# Altium project Mach_khuech_dai_am_thanh.PrjPcb
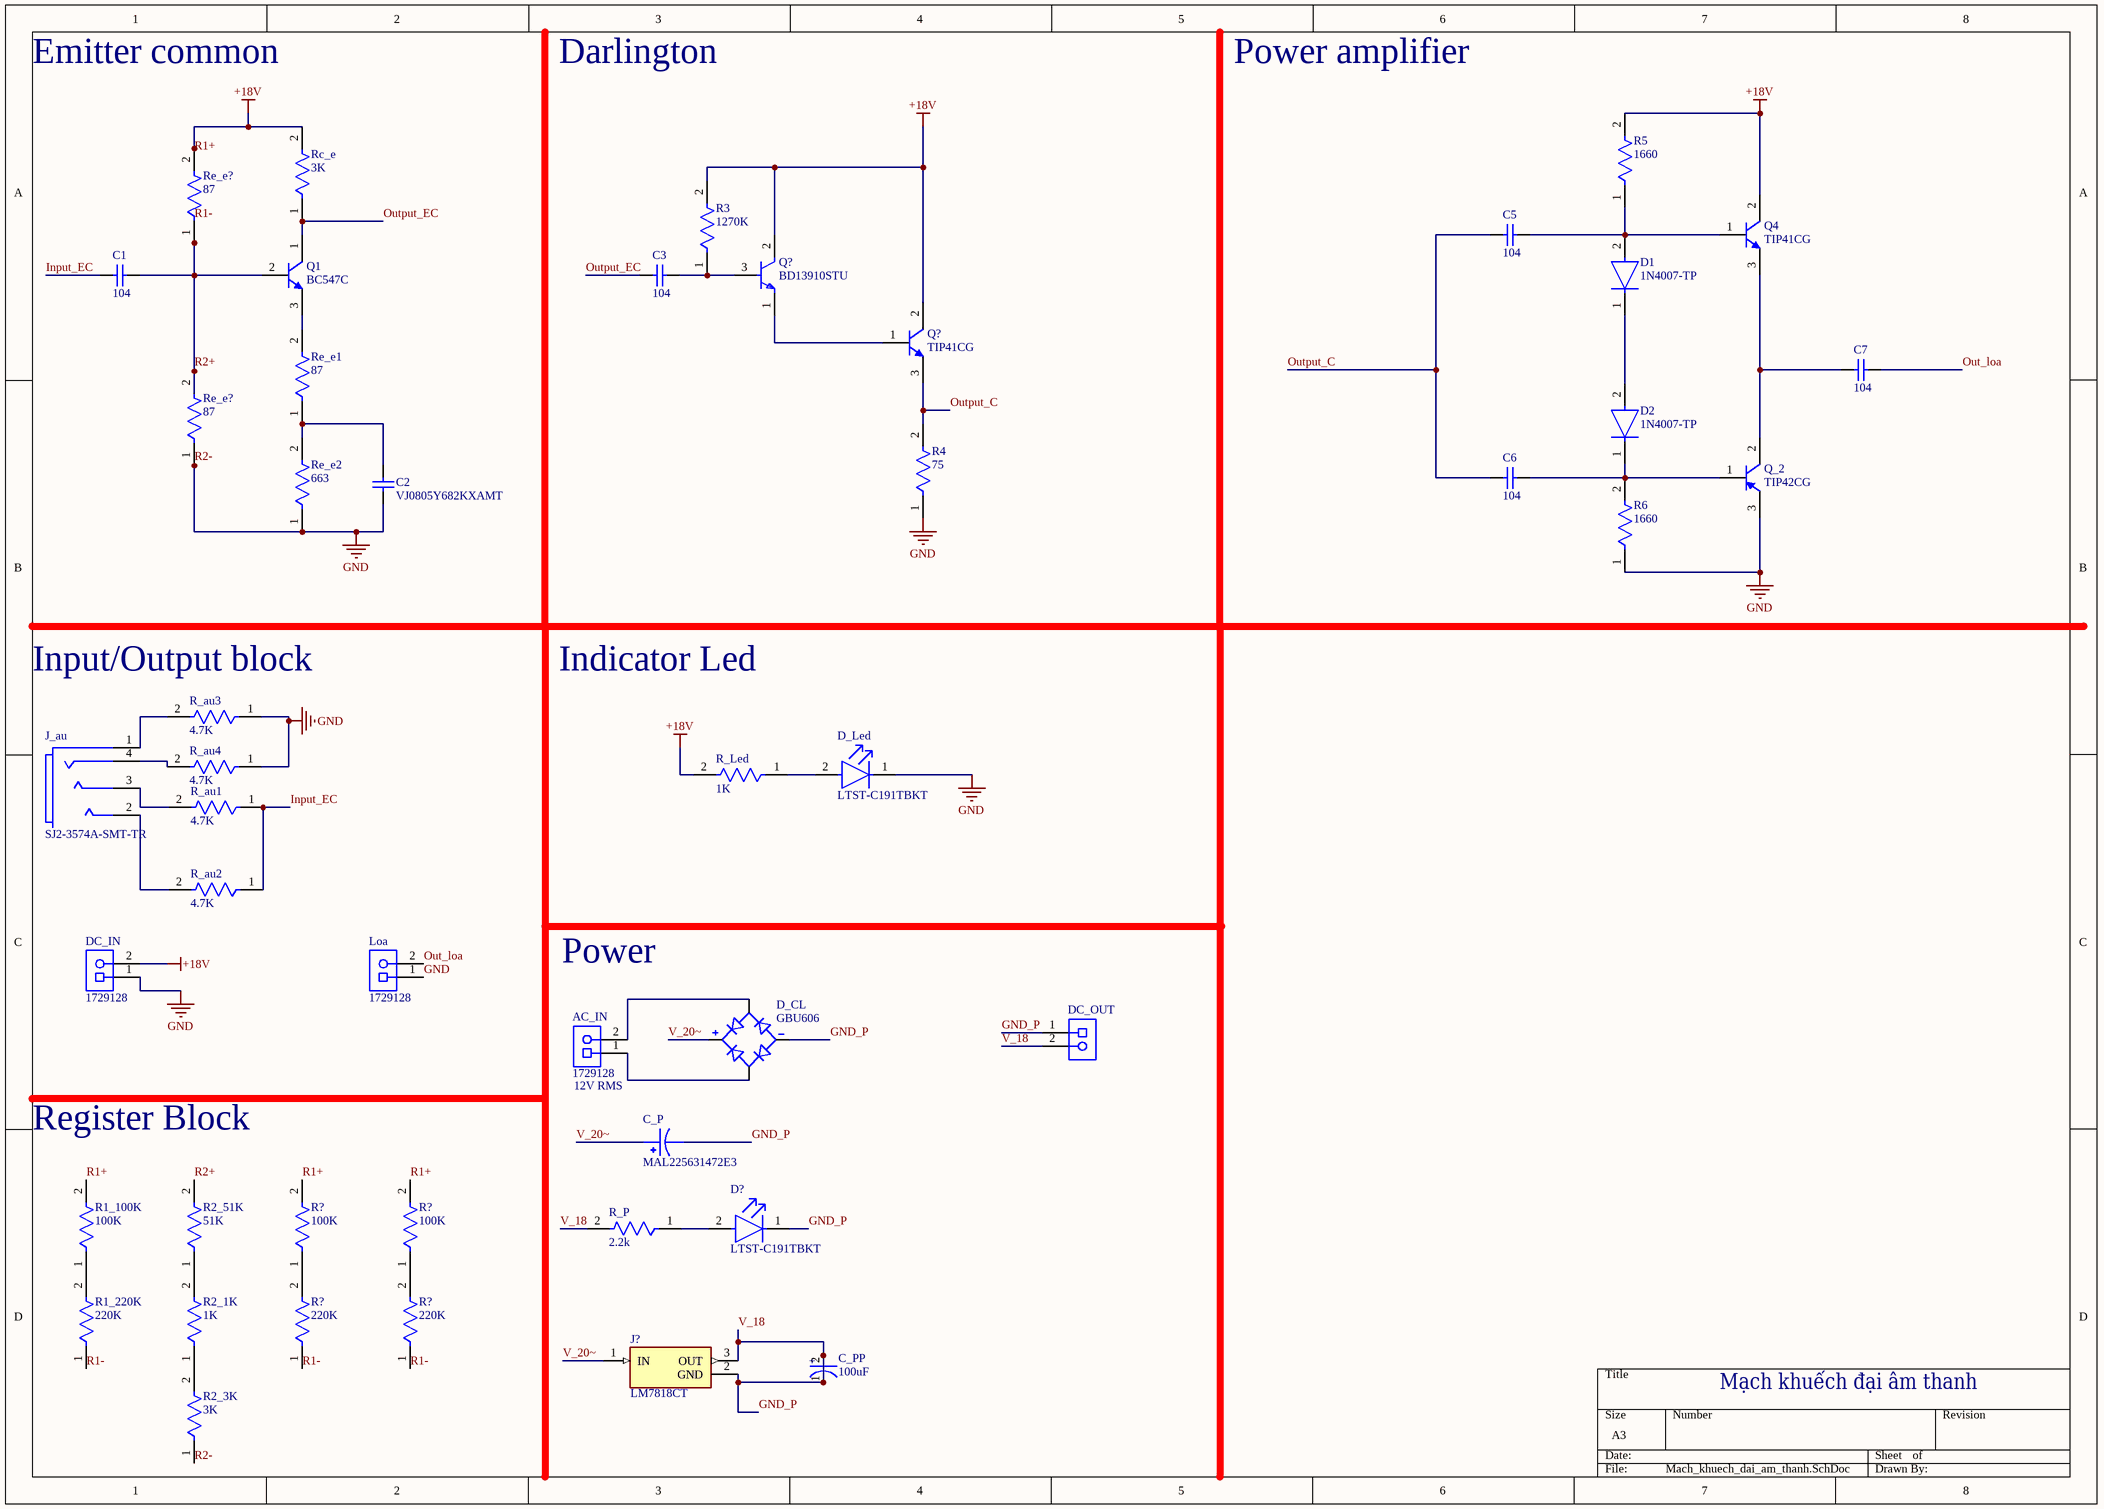
[diagram p0: Mach_khuech_dai_am_thanh.SchDoc]
1 sheet, 48 parts. Net scope: global (net labels, ports and power ports of the same name join across sheets).
Board file: Mach_khuech_dai_am_thanh.PcbDoc

## Sheet Mach_khuech_dai_am_thanh.SchDoc
size A3; SheetNumber: 1; SheetTotal: 1

### Parts
(Parts that share a designator on the sheet are numbered #1, #2 ... from top to bottom, then left to right.)
AC_IN  1729128  [PHOE-1729128-2_V]
C1  104  [CAPC2013X145X48ML20T23]
C2  VJ0805Y682KXAMT  [CAPC2013X145X48ML20T23]
C3  104  [CAPC2013X145X48ML20T23]
C5  104  [CAPC2013X145X48ML20T23]
C6  104  [CAPC2013X145X48ML20T23]
C7  104  [CAPC2013X145X48ML20T23]
C_P  MAL225631472E3  [CAP_MAL225631472E3]
C_PP  100uF  [FP-RAD-TH-D_10_0_5-L_16_1-MFG]
D1  1N4007-TP  [FP-1N4007-TP-MFG]
D2  1N4007-TP  [FP-1N4007-TP-MFG]
D?  LTST-C191TBKT  [FP-LTST-C191TBKT-MFG]
D_CL  GBU606  [SIP343W114P508L2205H2134Q4]
D_Led  LTST-C191TBKT  [FP-LTST-C191TBKT-MFG]
DC_IN  1729128  [PHOE-1729128-2_V]
DC_OUT  (no value)  [PHOE-1729128-2_V]
J?  LM7818CT  [TO-220-3]
J_au  SJ2-3574A-SMT-TR  [FP-SJ2-3574A-SMT-TR-MFG]
Loa  1729128  [PHOE-1729128-2_V]
Q1  BC547C  [ONSC-TO-92-3-29-11]
Q4  TIP41CG  [ONSC-TO-220-3-221A-09]
Q?#1  BD13910STU  [FP-340AS-MFG]
Q?#2  TIP41CG  [ONSC-TO-220-3-221A-09]
Q_2  TIP42CG  [ONSC-TO-220-3-221A-09]
R1_100K  100K  [FP-RK73H2A-MFG]
R1_220K  220K  [FP-RK73H2A-MFG]
R2_1K  1K  [FP-RK73H2A-MFG]
R2_3K  3K  [FP-RK73H2A-MFG]
R2_51K  51K  [FP-RK73H2A-MFG]
R3  1270K  [FP-RK73H2A-MFG]
R4  75  [FP-RK73H2A-MFG]
R5  1660  [FP-RK73H2A-MFG]
R6  1660  [FP-RK73H2A-MFG]
R?#1  100K  [FP-RK73H2A-MFG]
R?#2  100K  [FP-RK73H2A-MFG]
R?#3  220K  [FP-RK73H2A-MFG]
R?#4  220K  [FP-RK73H2A-MFG]
R_au1  4.7K  [FP-RK73H2A-MFG]
R_au2  4.7K  [FP-RK73H2A-MFG]
R_au3  4.7K  [FP-RK73H2A-MFG]
R_au4  4.7K  [FP-RK73H2A-MFG]
R_Led  1K  [FP-RK73H2A-MFG]
R_P  2.2k  [FP-RK73H2A-MFG]
Rc_e  3K  [FP-RK73H2A-MFG]
Re_e1  87  [FP-RK73H2A-MFG]
Re_e2  663  [FP-RK73H2A-MFG]
Re_e?#1  87  [FP-RK73H2A-MFG]
Re_e?#2  87  [FP-RK73H2A-MFG]

### Nets
GND: C2.1 D_Led.1(C) DC_IN.1 Loa.1 Q_2.3(E) R2_3K.1 R4.1 R6.1 R_au3.1 R_au4.1 Re_e2.1 Re_e?#2.1  [also labelled R2-]
R1+: DC_IN.2 Q4.2(C) Q?#1.2(C) Q?#2.2(C) R1_100K.2 R3.2 R5.2 R?#1.2 R?#2.2 R_Led.2 Rc_e.2 Re_e?#1.2  [also labelled +18V]
GND_P: C_P.2 C_PP.1(C) C_PP.2(A) D?.1(C) D_CL.NEG DC_OUT.1 DC_OUT.2 J?.2(GND) J?.3(OUT) R_P.2  [also labelled V_18]
Input_EC: C1.1 R_au1.1 R_au2.1
Out_loa: C7.2 Loa.2
Output_C: C5.1 C6.1 Q?#2.3(E) R4.2
Output_EC: C3.1 Q1.1(C) Rc_e.1
R1-: C1.2 Q1.2(B) R1_220K.1 R2_51K.2 R?#3.1 R?#4.1 Re_e?#1.1 Re_e?#2.2  [also labelled R2+]
V_20~: C_P.1 D_CL.POS J?.1(IN)
NetAC_IN_1: AC_IN.1 D_CL.AC2
NetAC_IN_2: AC_IN.2 D_CL.AC1
NetC2_2: C2.2 Re_e1.1 Re_e2.2
NetC3_2: C3.2 Q?#1.3(B) R3.1
NetC5_2: C5.2 D1.2(A) Q4.1(B) R5.1
NetC6_2: C6.2 D2.1(C) Q_2.1(B) R6.2
NetC7_1: C7.1 Q4.3(E) Q_2.2(C)
NetD1_1: D1.1(C) D2.2(A)
NetD?_2: D?.2(A) R_P.1
NetD_Led_2: D_Led.2(A) R_Led.1
NetJ_au_1: J_au.1(sleeve) R_au3.2
NetJ_au_2: J_au.2(tip) R_au2.2
NetJ_au_3: J_au.3(ring_1) R_au1.2
NetJ_au_4: J_au.4(ring_2) R_au4.2
NetQ1_3: Q1.3(E) Re_e1.2
NetQ?#1_1: Q?#1.1(E) Q?#2.1(B)
NetR1_100K_1: R1_100K.1 R1_220K.2
NetR2_1K_1: R2_1K.1 R2_3K.2
NetR2_1K_2: R2_1K.2 R2_51K.1
NetR?#1_1: R?#1.1 R?#3.2
NetR?#2_1: R?#2.1 R?#4.2

### Notes on the sheet
- Emitter common
- Darlington
- Power amplifier
- (near R_au3) Input/Output block
- Indicator Led
- Power
- (near AC_IN) 12V RMS
- Register Block
- Mạch khuếch đại âm thanh
- (in symbol CMP-05427-000510-1) +

### Library data of the parts
AC_IN DC_IN Loa = CMP-2000-05815-1: PCB Terminal Block, 13.5 A, 400 V, 2-Pin THD, RoHS, Bulk; Manufacturer: Phoenix Contact; Package Version: 03/2015; No. of Rows: 1; Pitch: 5.08mm; No. of Positions: 2; Voltage Rating: 400V; Current Rating: 13500mA; Manufacturer URL: http://www.phoenixcontact.com/; Datasheet URL: https://datasheet.ciiva.com/16046/1729128-16046181.pdf; RoHS: TRUE; Package URL: https://www.phoenixcontact.com/online/portal/pi/pxc/product_detail_page/!ut/p/b1/3VdJjqNKFDxLH8AFycySyWY2ozFsEPOMMQaDOX1XedGL_1Vdm5YXJleknhSKeBkvI6EA8ncAo3AYoDhBQGco6KN7VURTdemj9us_IEKEZo_YHiPAEWEFmDGOHMORkqKYCORBZxgL7ZoaZYcbFFUZ3fqxSY6GOuxydWUuHqz1ynmMFygu583Bob0Ewr6Sd_l-5m-kAueHiB0jpRwZwe58wwtkpxtMYd_LmGcDRU02dRNEyWt6Y2ti5pSyJ_reIkzIulrqApdnbT11V5jnCKbYNCvhEM1MCpPByat_X379-iThf08CI5GfOPqfBeS3BRoBOdD55AKVv0iLwCMq-2BrzXWSGRH7pUGD9uwXQjiph3xL0DKQwdGa0JImiIOmBNOestqgwTHSSs2oOep-78apyXQBvNi8ZLaFjvjWvcaUEBu0MC6Wbe-d6mB0FAebo2lUWinqYaZs5DAYzV0RP9yitUjnGJ0iI9xhZkT42OCQNUJJhkgWINNQLP2JFP6OpMg3JCVg70jqHT0lvKOnhHf0lPuOnnLf0VPuWx6_dxwUIvwk5WMkT0kLL1mh61l2yZVSzG3pYV_bqo-mj6uMKwKwdnnW8Jh5RTOJzMOA5c-eJDaZQw4mTMPH02PvS_ZAqNVjVTo2WyYLkwH_KU1mmmG5kjRhDqPXLwwVHvVOjCM60-fpXvTDfMGW1PVFVS1r4e4yVDk4ZdNbkUHvqPqQSeian4UD39fNKmachqdJ1NJbyk8rXT9mXTvPk3oE5meulKGgiruPJek-4I9hTT6G8ZLOyRSm2RRVbThERQad5OS28hdt4YW4vG0stgYYzsWsK4_7y6DZMjJSCqri1kyiZR5vD7pwIrNR7QwPHTcLTI5qT7eRlpHrdGiupYlqQDJ7zy_CND8fWWBoLRXxk1RVcXiBQwbTD4Xi7KL-FuO94t9xaqweXzH; PartNumber: 1729128; Package Description: 2-Pin Through Hole Device, Body 8.1 x 10.16 mm, Pitch 5.08 mm; Datasheet Version: 12/2013; Mounting Technology: ThroughHole; Orientation: Horizontal; Package Reference: 1729128-2; Packing: Bulk
C1 C3 C5-C7 = CMP-2007-03205-1: Manufacturer: Vitramon; Part Number: VJ0805Y682KXAMT
C2 = CMP-2007-03205-1: Manufacturer: Vitramon; Part Number: VJ0805Y682KXAMT
C_PP = CMP-05427-000510-1: Aluminum Electrolytic Capacitors (Radial Lead Type) AEC-Q200 Qualified 820uF ±20% 10V; ESR (Equivalent Series Resistance): 68mR; Ripple Current: 1.05A; Lead Diameter: 0.6mm; Dielectric Material: Aluminium; Leakage Current: 3uA; Life (Hours): 3000Hour; Package Quantity: 200; Construction: RADIAL; Radiation Hardening: No; Voltage Rating: 10V; Height - Seated (Max): 0.63inch; Case/Package: Radial; Lead Free: Lead Free; Voltage Rating (DC): 10V; Voltage: 10V; RoHS Compliant: Yes; Max Operating Temperature: 105°C; Number of Pins: 2; Impedance: 68mR; Length: 16mm; REACH SVHC: No SVHC; Lead Pitch: 5mm; Termination: Radial; Mount: Through Hole; Capacitance: 820uF; Min Operating Temperature: -55°C; Diameter: 10mm; Height: 16mm; Ripple Current (AC): 1.05A; Series: FC; Packaging: Bulk; Tolerance: 20%
D1 D2 = CMP-56207-000011-1: DIODE GEN PURP 1KV 1A DO41; Max Surge Current: 30A; Recovery Time: 2000ns; Element Configuration: Single; Polarity: Standard; Reverse Recovery Time: 2us; Capacitance: 15pF; Forward Voltage: 1V; Max Reverse Current: 5uA; Radiation Hardening: No; Number of Pins: 2; Current Rating: 1A; Reverse Voltage: 1kV; Output Current: 1A; Mount: Through Hole; Average Rectified Current: 1A; Lead Free: Lead Free; Peak Non-Repetitive Surge Current: 30A; Max Reverse Voltage (DC): 1kV; Voltage Rating (DC): 1kV; Max Repetitive Reverse Voltage (Vrrm): 1kV; Diameter: 2.7mm; Forward Current: 1A; RoHS Compliant: Yes; Package Quantity: 1; Length: 5.2mm; Max Forward Surge Current (Ifsm): 30A; Packaging: Tape and Reel; Case/Package: DO-41; Min Operating Temperature: -55°C; Max Operating Temperature: 150°C
D? D_Led = CMP-22017-000008-1: LED BLUE CLEAR CHIP SMD; Lens Color: Colorless; Dominant Wavelength: 475nm; Forward Current: 20mA; Wavelength: 468nm; Viewing Angle: 130°; Power Dissipation: 76mW; Luminous Intensity: 180mcd; Reverse Voltage: 5V; Number of Elements: 1; Lens Style: Diffused; Forward Voltage: 3.8V; Max Power Dissipation: 75mW; Case Code (Metric): 1608; Packaging: Tape and Reel; Case/Package: 0603; Depth: 1.6mm; Mount: Surface Mount; Lead Free: Lead Free; Min Operating Temperature: -20°C; Lens Transparency: Clear; Illumination Color: Blue; Height: 0.55mm; Test Current: 20mA; Case Code (Imperial): 0603; Max Operating Temperature: 80°C; Number of Pins: 2; Length: 0.8mm; Radiation Hardening: No; Package Quantity: 1; Number of LEDs: 1; Width: 0.8mm; Color: Blue
D_CL = GBU606: 6A 600V Bridge Rectifier Case GBU | Diodes Inc GBU606; MF: Diodes Inc.; SnapEDA_Link: https://www.snapeda.com/parts/GBU606/Diodes+Inc./view-part/?ref=snap; Package: SIP-4 Diodes Incorporated; Value: *; MP: GBU606; Check_prices: https://www.snapeda.com/parts/GBU606/Diodes+Inc./view-part/?ref=eda
DC_OUT = CMP-2000-05815-1: PCB Terminal Block, 13.5 A, 400 V, 2-Pin THD, RoHS, Bulk; PartNumber: 1729128; Manufacturer: Phoenix Contact; Package Version: 03/2015; No. of Rows: 1; Pitch: 5.08mm; No. of Positions: 2; Voltage Rating: 400V; Current Rating: 13500mA; Manufacturer URL: http://www.phoenixcontact.com/; Datasheet URL: https://datasheet.ciiva.com/16046/1729128-16046181.pdf; RoHS: TRUE; Package URL: https://www.phoenixcontact.com/online/portal/pi/pxc/product_detail_page/!ut/p/b1/3VdJjqNKFDxLH8AFycySyWY2ozFsEPOMMQaDOX1XedGL_1Vdm5YXJleknhSKeBkvI6EA8ncAo3AYoDhBQGco6KN7VURTdemj9us_IEKEZo_YHiPAEWEFmDGOHMORkqKYCORBZxgL7ZoaZYcbFFUZ3fqxSY6GOuxydWUuHqz1ynmMFygu583Bob0Ewr6Sd_l-5m-kAueHiB0jpRwZwe58wwtkpxtMYd_LmGcDRU02dRNEyWt6Y2ti5pSyJ_reIkzIulrqApdnbT11V5jnCKbYNCvhEM1MCpPByat_X379-iThf08CI5GfOPqfBeS3BRoBOdD55AKVv0iLwCMq-2BrzXWSGRH7pUGD9uwXQjiph3xL0DKQwdGa0JImiIOmBNOestqgwTHSSs2oOep-78apyXQBvNi8ZLaFjvjWvcaUEBu0MC6Wbe-d6mB0FAebo2lUWinqYaZs5DAYzV0RP9yitUjnGJ0iI9xhZkT42OCQNUJJhkgWINNQLP2JFP6OpMg3JCVg70jqHT0lvKOnhHf0lPuOnnLf0VPuWx6_dxwUIvwk5WMkT0kLL1mh61l2yZVSzG3pYV_bqo-mj6uMKwKwdnnW8Jh5RTOJzMOA5c-eJDaZQw4mTMPH02PvS_ZAqNVjVTo2WyYLkwH_KU1mmmG5kjRhDqPXLwwVHvVOjCM60-fpXvTDfMGW1PVFVS1r4e4yVDk4ZdNbkUHvqPqQSeian4UD39fNKmachqdJ1NJbyk8rXT9mXTvPk3oE5meulKGgiruPJek-4I9hTT6G8ZLOyRSm2RRVbThERQad5OS28hdt4YW4vG0stgYYzsWsK4_7y6DZMjJSCqri1kyiZR5vD7pwIrNR7QwPHTcLTI5qT7eRlpHrdGiupYlqQDJ7zy_CND8fWWBoLRXxk1RVcXiBQwbTD4Xi7KL-FuO94t9xaqweXzH; Package Description: 2-Pin Through Hole Device, Body 8.1 x 10.16 mm, Pitch 5.08 mm; Datasheet Version: 12/2013; Mounting Technology: ThroughHole; Orientation: Horizontal; Package Reference: 1729128-2; Packing: Bulk
J? = LM7818CT: Linear Voltage Regulator IC Positive Fixed 1 Output 1A TO-220-3; MF: ON Semiconductor; Check_prices: https://www.snapeda.com/parts/LM7818CT/Onsemi/view-part/?ref=eda; Value: *; Availability: In Stock; MP: LM7818CT; Price: None; Package: TO-220-3 ON Semiconductor; SnapEDA_Link: https://www.snapeda.com/parts/LM7818CT/Onsemi/view-part/?ref=snap; Purchase-URL: https://pricing.snapeda.com/search/part/LM7818CT/?ref=eda
J_au = CMP-14818-000001-1: Manufacturer: CUI; Conn Orientation: Horizontal; Current Rating: 1A; Number Of Contacts: 4; Voltage Rating: 12V; Package: SJ2-3574A-SMT-TR; Device Class L1: Connectors; Lead Free: Yes; Digikey Description: AUDIO JACK, 3.5 MM, RT, 4 CONDUC; Device Class L2: Audio / Video Connectors; ComponentLink2URL: https://www.cui.com/product/resource/sj2-357x-smt.pdf; Automotive: No; RoHS: TRUE; Height: 5.3mm; Temperature Range Low: -25°C; Category: Conn; Temperature: -25°C to +85°C; Octopart: https://octopart.com/sj2-3574a-smt-tr-cui-77838840; Device Class L3: unset; Contact Material: Silver; Manufacturer Part Number: SJ2-3574A-SMT-TR; Temperature Range High: +85°C; ComponentLink2Description: Datasheet
Q1 = CMP-1048-01437-1: Amplifier Transistor, NPN Silicon, 3-Pin TO-92, Bulk Box; Manufacturer: On Semiconductor; IC Continuous (A): 0.1; fT Min (MHz): 150; Mounting Technology: Through Hole; ComponentLink1URL: http://www.onsemi.com/; ComponentLink1Description: Manufacturer URL; ComponentLink3URL: http://www.onsemi.cn/pub_link/Collateral/2N6426-D.PDF; DatasheetVersion: Rev. 7; PackageVersion: Rev. AM; Packing: Bulk Box; RoHS: FALSE; Polarity: NPN; PartNumber: BC547C; ComponentLink2URL: http://www.onsemi.com/pub_link/Collateral/BC546-D.PDF; ComponentLink3Description: Package Specification; PackageDescription: 3-Pin Transistor Outline, Body 4.825 x 3.685 mm, Pitch 1.27 mm; PackageReference: TO-92-3-29-11_AM_SL; ComponentLink2Description: Datasheet
Q4 Q?#2 = CMP-1048-01176-1: Complementary Silicon Plastic Power Transistor, 3-Pin TO-220, Pb-Free, Tube; Manufacturer: On Semiconductor; fT Min (MHz): 3; Polarity: NPN; IC Continuous (A): 6; ComponentLink2URL: http://www.onsemi.com/pub_link/Collateral/TIP41A-D.PDF; ComponentLink2Description: Datasheet; RoHS: TRUE; ComponentLink1Description: Manufacturer URL; ComponentLink1URL: http://www.onsemi.com/; PackageDescription: 3-Pin Flange Mount, Vertical Straight Lead, Body 9.97 x 4.445 mm, Pitch 2.54 mm; Packing: Tube; PartNumber: TIP41CG; DatasheetVersion: Rev. 10; PackageVersion: Rev. AG, 09/2011; ComponentLink3Description: Package Specification; PackageReference: TO-220-3-221A-09; Mounting Technology: Through Hole; ComponentLink3URL: http://www.onsemi.com/pub_link/Collateral/221A-09.PDF
Q?#1 = CMP-00278-84408974-1: BD13910STU Bipolar (BJT) Single Transistor, NPN, 80 V, 12.5 W, 1.5 A, 63; Manufacturer Lifecycle Status: ACTIVE; Max Power Dissipation: 1.25W; Collector Base Voltage (VCBO): 80V; Current Rating: 1.5A; hFE Min: 40; Number of Elements: 1; Collector Emitter Saturation Voltage: 500mV; Emitter Base Voltage (VEBO): 5V; Number of Pins: 3; Min Operating Temperature: -55°C; Contact Plating: Tin; Height: 11.2mm; Collector Emitter Breakdown Voltage: 80V; Weight: 761mg; Collector Emitter Voltage (VCEO): 80V; Voltage Rating (DC): 80V; Polarity: NPN; Length: 8.3mm; Lifecycle Status: Production; RoHS: Compliant; Max Collector Current: 1.5A; Case/Package: TO-126; Schedule B: 8541290080, 8541290080; Width: 3.45mm; Max Operating Temperature: 150°C; Lead Free: Lead Free; Mount: Through Hole; REACH SVHC: No SVHC; Element Configuration: Single; NexarPartId: 84408974; Power Dissipation: 1.25W
Q_2 = CMP-1048-01106-1: Complementary Silicon Plastic Power Transistor, 3-Pin TO-220, Pb-Free, Tube; Manufacturer: On Semiconductor; IC Continuous (A): 6; Polarity: PNP; fT Min (MHz): 3; ComponentLink2Description: Datasheet; ComponentLink1URL: http://www.onsemi.com/; ComponentLink2URL: http://www.onsemi.com/pub_link/Collateral/TIP41A-D.PDF; PackageVersion: Rev. AG, 09/2011; PartNumber: TIP42CG; ComponentLink3URL: http://www.onsemi.com/pub_link/Collateral/221A-09.PDF; PackageDescription: 3-Pin Flange Mount, Vertical Straight Lead, Body 9.97 x 4.445 mm, Pitch 2.54 mm; ComponentLink1Description: Manufacturer URL; Packing: Tube; ComponentLink3Description: Package Specification; PackageReference: TO-220-3-221A-09; RoHS: TRUE; DatasheetVersion: Rev. 10; Mounting Technology: Through Hole
R1_100K R1_220K R2_1K R2_3K R2_51K R3-R6 R?#1-R?#4 R_au1-R_au4 R_Led R_P Rc_e Re_e1 Re_e2 Re_e?#1 Re_e?#2 = CMP-04015-103638-1: 732kΩ ±1% 0.25W Chip Resistor 0805 Thick Film AEC-Q200 Qualified; Temperature Coefficient: 100ppm/°C; Power Rating: 125mW; Voltage Rating (DC): 150V; Resistance: 732kR; Packaging: Tape and Reel; Width: 1.25mm; Height: 0.5mm; Length: 2mm; Min Operating Temperature: -55°C; Case Code (Imperial): 0805; Max Operating Temperature: 155°C; Series: RK73H; Package Quantity: 5000; Case Code (Metric): 2012; Lead Free: Contains Lead; Termination: SMD/SMT; RoHS Compliant: No; Tolerance: 1%; Voltage Rating: 150V; Case/Package: 0805
C_P = MAL225631472E3: Package: None; Price: None; Value: *; MP: MAL225631472E3; Availability: Unavailable